# Altium schematic sheet CPU_STM32H7.SchDoc
size A3
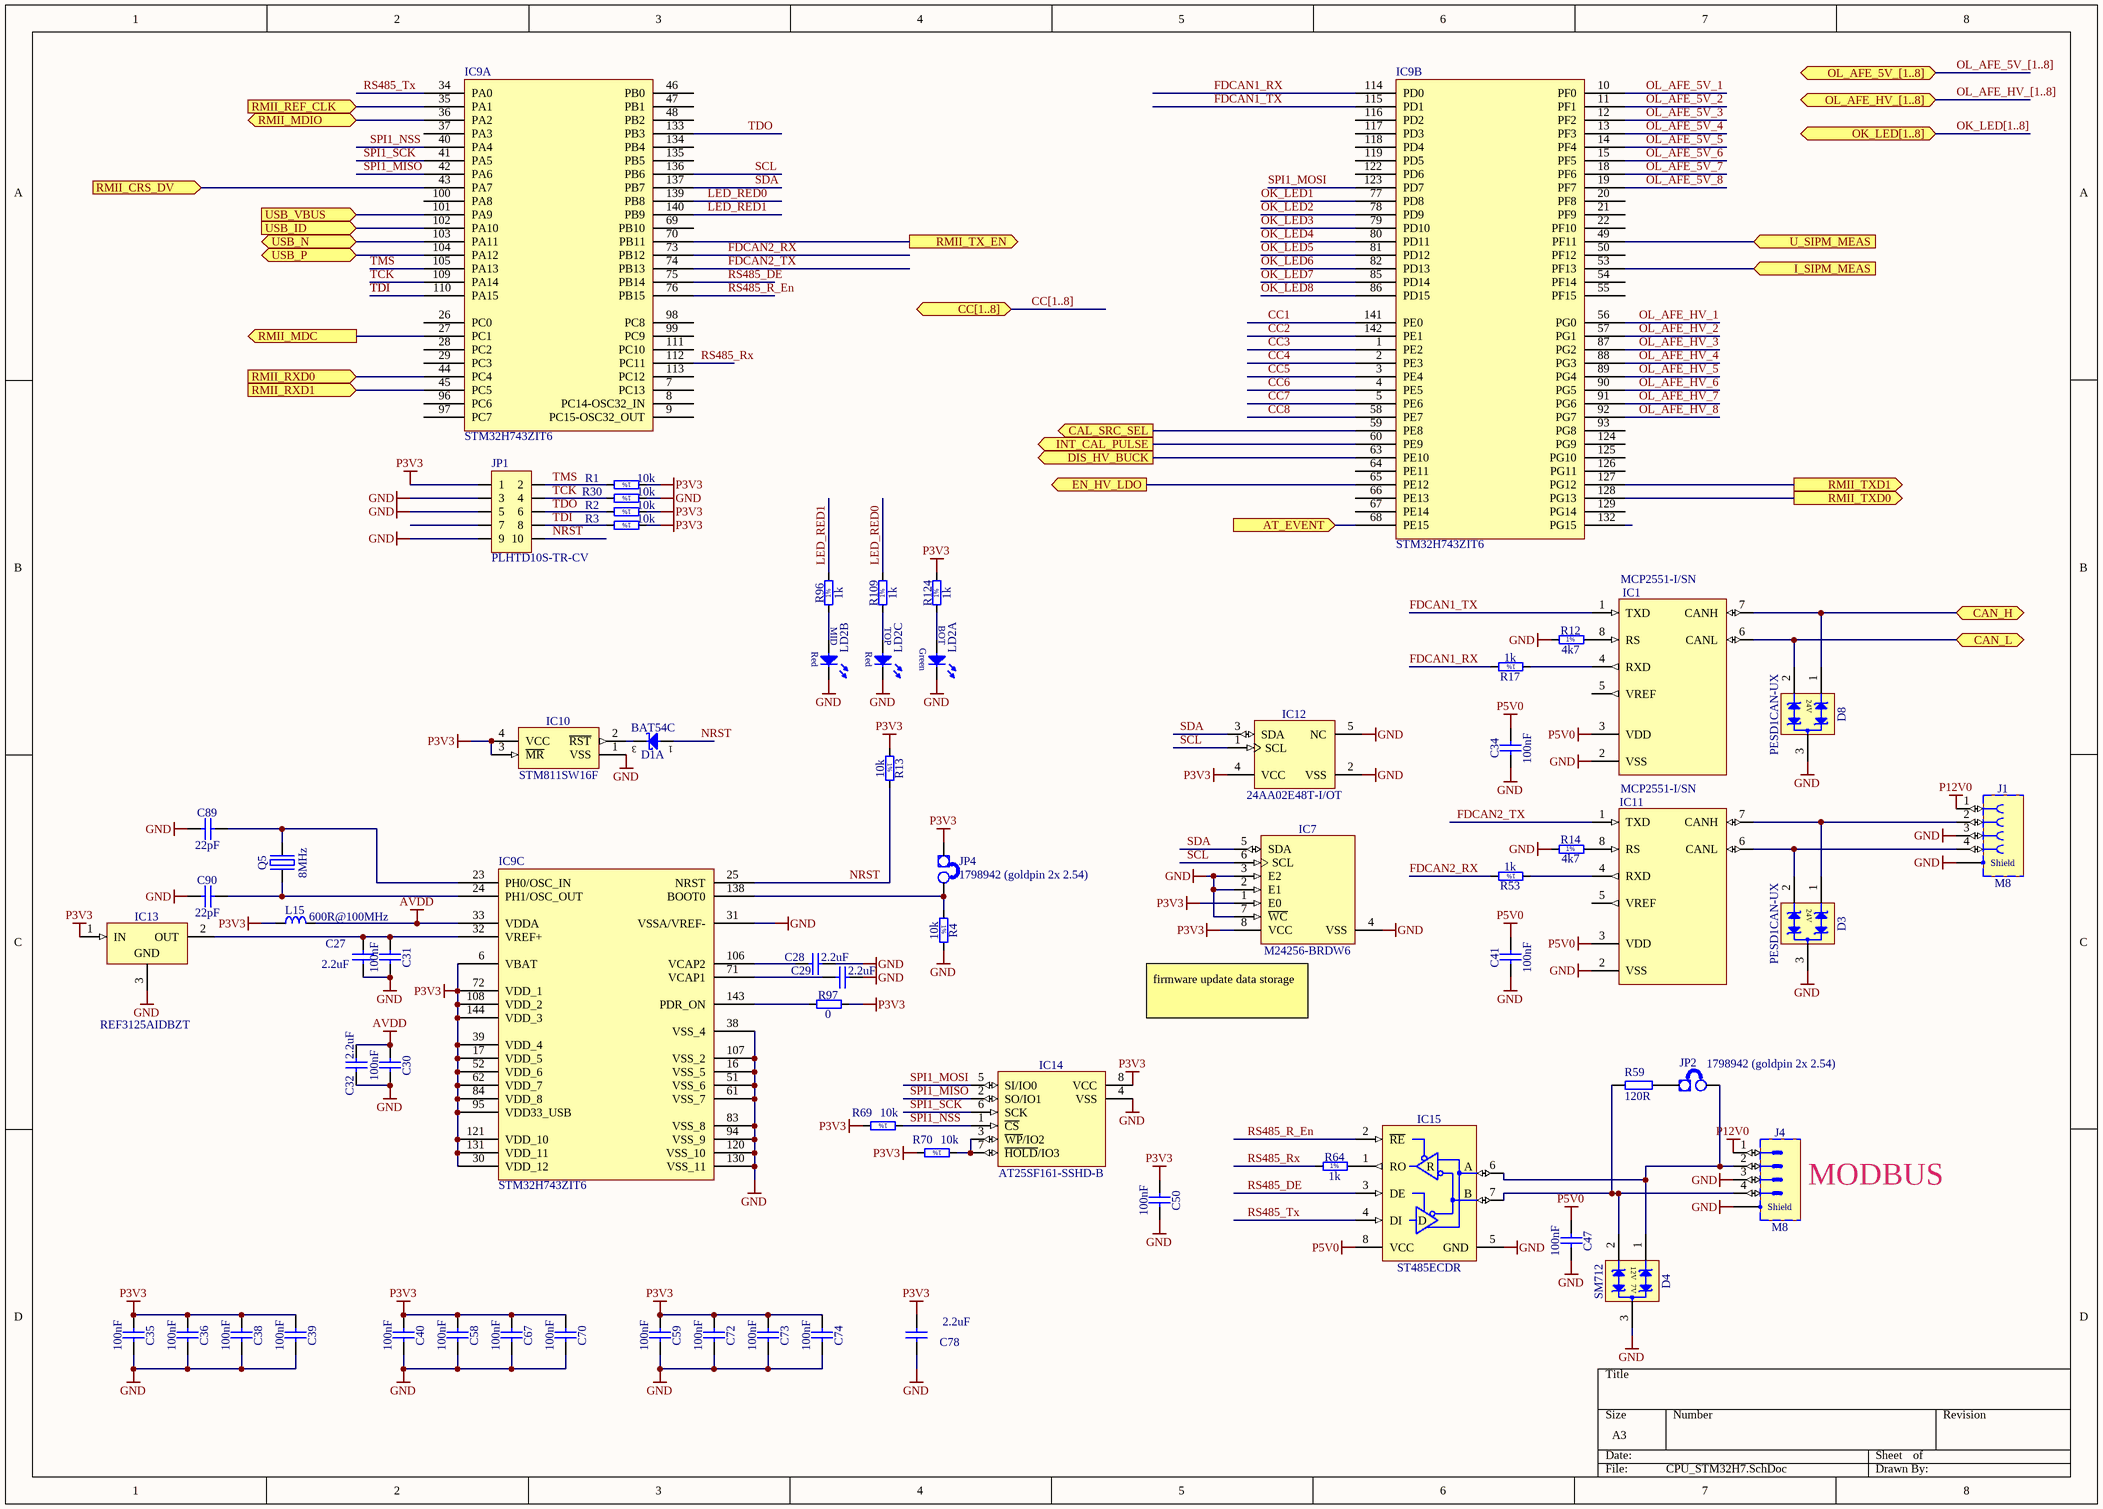
[diagram p0: CPU_STM32H7.SchDoc]

## Parts
C27  2.2uF  [CAPC1608X90N]
C28  2.2uF  [CAPC1608X90N]
C29  2.2uF  [CAPC1608X90N]
C30  100nF  [CAPC1005X55N]
C31  100nF  [CAPC1005X55N]
C32  2.2uF  [CAPC1608X90N]
C34  100nF  [CAPC1005X55N]
C35  100nF  [CAPC1005X55N]
C36  100nF  [CAPC1005X55N]
C38  100nF  [CAPC1005X55N]
C39  100nF  [CAPC1005X55N]
C40  100nF  [CAPC1005X55N]
C41  100nF  [CAPC1005X55N]
C47  100nF  [CAPC1005X55N]
C50  100nF  [CAPC1005X55N]
C58  100nF  [CAPC1005X55N]
C59  100nF  [CAPC1005X55N]
C67  100nF  [CAPC1005X55N]
C70  100nF  [CAPC1005X55N]
C72  100nF  [CAPC1005X55N]
C73  100nF  [CAPC1005X55N]
C74  100nF  [CAPC1005X55N]
C78  2.2uF  [CAPC1608X90N]
C89  22pF  [CAPC1005X55N]
C90  22pF  [CAPC1005X55N]
D1  BAT54C  [SOT95P240X130-3N]  (part A of 2)
D3  PESD1CAN-UX  [SOT95P237X112-3N]
D4  SM712  [SOT95P237X112-3N]
D8  PESD1CAN-UX  [SOT95P237X112-3N]
IC1  MCP2551-I/SN  [SOIC127P600X175-8N]
IC7  M24256-BRDW6  [SOP65P640X120-8N]
IC9  STM32H743ZIT6  [TSQFP50P2200X2200X160-144N]  (parts A,B,C of 3)
IC10  STM811SW16F  [SOT143N]
IC11  MCP2551-I/SN  [SOIC127P600X175-8N]
IC12  24AA02E48T-I/OT  [SOT95P280X145-5N]
IC13  REF3125AIDBZT  [SOT95P237X112-3N]
IC14  AT25SF161-SSHD-B  [SOIC127P790X216-8N]
IC15  ST485ECDR  [SOIC127P600X175-8N]
J1  M8  [AMPHENOL_M8AS-04PFFR-SF8001]
J4  M8  [AMPHENOL_M8AS-04PMMR-SF8001]
JP1  PLHTD10S-TR-CV  [PLHTD10S-TR-CV]
JP2  1798942 (goldpin 2x 2.54)  [jump]
JP4  1798942 (goldpin 2x 2.54)  [jump]
L15  600R@100MHz  [INDC1005X55N]
LD2  Red/Red/Green  [LED_DIALIGHT_570-0100-112F]  (value not drawn)  (parts A,B,C of 3)
Q5  8MHz  [XTAL_TXC_7A]
R1  10k  [RESC1005X40N]
R2  10k  [RESC1005X40N]
R3  10k  [RESC1005X40N]
R4  10k  [RESC1005X40N]
R12  4k7  [RESC1005X40N]
R13  10k  [RESC1005X40N]
R14  4k7  [RESC1005X40N]
R17  1k  [RESC1005X40N]
R30  10k  [RESC1005X40N]
R53  1k  [RESC1005X40N]
R59  120R  [1206R]
R64  1k  [RESC1005X40N]
R69  10k  [RESC1005X40N]
R70  10k  [RESC1005X40N]
R96  1k  [RESC1005X40N]
R97  0  [RESC1608X55N]
R109  1k  [RESC1005X40N]
R124  1k  [RESC1005X40N]

## Ports
AT_EVENT (in), CAL_SRC_SEL (out), CAN_H (bidir), CAN_L (bidir), CC[1..8] (bidir), DIS_HV_BUCK (out), EN_HV_LDO (out), I_SIPM_MEAS (in), INT_CAL_PULSE (out), OK_LED[1..8] (bidir), OL_AFE_5V_[1..8] (bidir), OL_AFE_HV_[1..8] (bidir), RMII_CRS_DV (in), RMII_MDC (out), RMII_MDIO (bidir), RMII_REF_CLK (in), RMII_RXD0 (in), RMII_RXD1 (in), RMII_TX_EN (out), RMII_TXD0 (out), RMII_TXD1 (out), U_SIPM_MEAS (in), USB_ID (in), USB_N (bidir), USB_P (bidir), USB_VBUS (in)

## Nets
AVDD: C30.1 C32.2 IC9.33(VDDA) L15.2
GND: C27.1 C28.2 C29.2 C30.2 C31.2 C32.1 C34.1 C35.2 C36.2 C38.2 C39.2 C40.2 C41.1 C47.2 C50.2 C58.2 C59.2 C67.2 C70.2 C72.2 C73.2 C74.2 C78.1 C89.1 C90.1 D3.3(GND) D4.3(GND) D8.3(GND) IC1.2(VSS) IC7.2(E1) IC7.3(E2) IC7.4(VSS) IC7.7(~{WC}) IC9.16(VSS_5) IC9.31(VSSA/VREF-) IC9.38(VSS_4) IC9.51(VSS_6) IC9.61(VSS_7) IC9.83(VSS_8) IC9.94(VSS_9) IC9.107(VSS_2) IC9.120(VSS_10) IC9.130(VSS_11) IC10.1(VSS) IC11.2(VSS) IC12.2(VSS) IC12.5(NC) IC13.3(GND) IC14.4(VSS) IC15.5(GND) J1.3 J1.SHIELD J4.3 J4.SHIELD JP1.3 JP1.5 JP1.9 LD2.2(C) LD2.4(C) LD2.6(C) R4.2 R12.1 R14.1 R30.1
P3V3: C35.1 C36.1 C38.1 C39.1 C40.1 C50.1 C58.1 C59.1 C67.1 C70.1 C72.1 C73.1 C74.1 C78.2 IC7.1(E0) IC7.8(VCC) IC9.6(VBAT) IC9.17(VDD_5) IC9.30(VDD_12) IC9.39(VDD_4) IC9.52(VDD_6) IC9.62(VDD_7) IC9.72(VDD_1) IC9.84(VDD_8) IC9.95(VDD33_USB) IC9.108(VDD_2) IC9.121(VDD_10) IC9.131(VDD_11) IC9.144(VDD_3) IC10.3(~{MR}) IC10.4(VCC) IC12.4(VCC) IC13.1(IN) IC14.8(VCC) JP1.1 JP4.1(E1) L15.1 R1.1 R2.1 R3.1 R13.1 R69.2 R70.2 R97.2 R124.2
P5V0: C34.2 C41.2 C47.1 IC1.3(VDD) IC11.3(VDD) IC15.8(VCC)
P12V0: J1.1 J4.1
AT_EVENT: IC9.68(PE15) ; port AT_EVENT
CAL_SRC_SEL: IC9.59(PE8) ; port CAL_SRC_SEL
CAN_H: D8.1(I/O1) IC1.7(CANH) ; port CAN_H
CAN_L: D8.2(I/O2) IC1.6(CANL) ; port CAN_L
CC1: IC9.141(PE0)
CC2: IC9.142(PE1)
CC3: IC9.1(PE2)
CC4: IC9.2(PE3)
CC5: IC9.3(PE4)
CC6: IC9.4(PE5)
CC7: IC9.5(PE6)
CC8: IC9.58(PE7)
DIS_HV_BUCK: IC9.63(PE10) ; port DIS_HV_BUCK
EN_HV_LDO: IC9.65(PE12) ; port EN_HV_LDO
FDCAN1_RX: IC9.114(PD0) R17.2
FDCAN1_TX: IC1.1(TXD) IC9.115(PD1)
FDCAN2_RX: IC9.73(PB12) R53.2
FDCAN2_TX: IC9.74(PB13) IC11.1(TXD)
I_SIPM_MEAS: IC9.53(PF13) ; port I_SIPM_MEAS
INT_CAL_PULSE: IC9.60(PE9) ; port INT_CAL_PULSE
LED_RED0: IC9.139(PB8) R109.2
LED_RED1: IC9.140(PB9) R96.2
NRST: D1.1(A) IC9.25(NRST) JP1.10 R13.2
OK_LED1: IC9.77(PD8)
OK_LED2: IC9.78(PD9)
OK_LED3: IC9.79(PD10)
OK_LED4: IC9.80(PD11)
OK_LED5: IC9.81(PD12)
OK_LED6: IC9.82(PD13)
OK_LED7: IC9.85(PD14)
OK_LED8: IC9.86(PD15)
OL_AFE_5V_1: IC9.10(PF0)
OL_AFE_5V_2: IC9.11(PF1)
OL_AFE_5V_3: IC9.12(PF2)
OL_AFE_5V_4: IC9.13(PF3)
OL_AFE_5V_5: IC9.14(PF4)
OL_AFE_5V_6: IC9.15(PF5)
OL_AFE_5V_7: IC9.18(PF6)
OL_AFE_5V_8: IC9.19(PF7)
OL_AFE_HV_1: IC9.56(PG0)
OL_AFE_HV_2: IC9.57(PG1)
OL_AFE_HV_3: IC9.87(PG2)
OL_AFE_HV_4: IC9.88(PG3)
OL_AFE_HV_5: IC9.89(PG4)
OL_AFE_HV_6: IC9.90(PG5)
OL_AFE_HV_7: IC9.91(PG6)
OL_AFE_HV_8: IC9.92(PG7)
RMII_CRS_DV: IC9.43(PA7) ; port RMII_CRS_DV
RMII_MDC: IC9.27(PC1) ; port RMII_MDC
RMII_MDIO: IC9.36(PA2) ; port RMII_MDIO
RMII_REF_CLK: IC9.35(PA1) ; port RMII_REF_CLK
RMII_RXD0: IC9.44(PC4) ; port RMII_RXD0
RMII_RXD1: IC9.45(PC5) ; port RMII_RXD1
RMII_TX_EN: IC9.70(PB11) ; port RMII_TX_EN
RMII_TXD0: IC9.128(PG13) ; port RMII_TXD0
RMII_TXD1: IC9.127(PG12) ; port RMII_TXD1
RS485_DE: IC9.75(PB14) IC15.3(DE)
RS485_R_En: IC9.76(PB15) IC15.2(~{RE})
RS485_Rx: IC9.112(PC11) R64.1
RS485_Tx: IC9.34(PA0) IC15.4(DI)
SCL: IC7.6(SCL) IC9.136(PB6) IC12.1(SCL)
SDA: IC7.5(SDA) IC9.137(PB7) IC12.3(SDA)
SPI1_MISO: IC9.42(PA6) IC14.2(SO/IO1)
SPI1_MOSI: IC9.123(PD7) IC14.5(SI/IO0)
SPI1_NSS: IC9.40(PA4) IC14.1(~{CS}) R69.1
SPI1_SCK: IC9.41(PA5) IC14.6(SCK)
TCK: IC9.109(PA14) JP1.4 R30.2
TDI: IC9.110(PA15) JP1.8 R3.2
TDO: IC9.133(PB3) JP1.6 R2.2
TMS: IC9.105(PA13) JP1.2 R1.2
U_SIPM_MEAS: IC9.49(PF11) ; port U_SIPM_MEAS
USB_ID: IC9.102(PA10) ; port USB_ID
USB_N: IC9.103(PA11) ; port USB_N
USB_P: IC9.104(PA12) ; port USB_P
USB_VBUS: IC9.101(PA9) ; port USB_VBUS
NetC27_2: C27.2 C31.1 IC9.32(VREF+) IC13.2(OUT)
NetC28_1: C28.1 IC9.106(VCAP2)
NetC29_1: C29.1 IC9.71(VCAP1)
NetC89_2: C89.2 IC9.23(PH0/OSC_IN) Q5.2(OSC2)
NetC90_2: C90.2 IC9.24(PH1/OSC_OUT) Q5.1(OSC1)
NetD1_3: D1.3(COMC) IC10.2(~{RST})
NetD3_1: D3.1(I/O1) IC11.7(CANH) J1.2
NetD3_2: D3.2(I/O2) IC11.6(CANL) J1.4
NetD4_1: D4.1(I/O1) IC15.6(A) J4.2 JP2.2(E2)
NetD4_2: D4.2(I/O2) IC15.7(B) J4.4 R59.1
NetIC1_4: IC1.4(RXD) R17.1
NetIC1_8: IC1.8(RS) R12.2
NetIC9_138: IC9.138(BOOT0) JP4.2(E2) R4.1
NetIC9_143: IC9.143(PDR_ON) R97.1
NetIC11_4: IC11.4(RXD) R53.1
NetIC11_8: IC11.8(RS) R14.2
NetIC14_3: IC14.3(~{WP}/IO2) IC14.7(~{HOLD}/IO3) R70.1
NetIC15_1: IC15.1(RO) R64.2
NetJP2_1: JP2.1(E1) R59.2
NetLD2_1: LD2.1(A) R124.1
NetLD2_3: LD2.3(A) R96.1
NetLD2_5: LD2.5(A) R109.1

Not connected (* = marked no-connect by the designer): IC1 5(VREF); IC9 7(PC13) 8(PC14-OSC32_IN) 9(PC15-OSC32_OUT) 20(PF8) 21(PF9) 22(PF10) 26(PC0) 28(PC2) 29(PC3) 37(PA3) 46(PB0) 47(PB1) 48(PB2) 50(PF12) 54(PF14) 55(PF15) 64(PE11) 66(PE13) 67(PE14) 69(PB10) 93(PG8) 96(PC6) 97(PC7) 98(PC8) 99(PC9) 100(PA8) 111(PC10) 113(PC12) 116(PD2) 117(PD3) 118(PD4) 119(PD5) 122(PD6) 124(PG9) 125(PG10) 126(PG11) 129(PG14) 132(PG15) 134(PB4) 135(PB5); IC11 5(VREF); JP1 7

## Buses and harness runs
bus CC[1..8] = port CC[1..8]
bus OK_LED[1..8] = port OK_LED[1..8]
bus OL_AFE_5V_[1..8] = port OL_AFE_5V_[1..8]
bus OL_AFE_HV_[1..8] = port OL_AFE_HV_[1..8]

## Notes on the sheet
- (near IC7) firmware update data storage
- (near J4) MODBUS
- (in symbol AMPHENOL_M8AS-04PFFR-SF8001) Shield
- (in symbol AMPHENOL_M8AS-04PMMR-SF8001) Shield
- (in symbol LED_DIALIGHT_570-0100-112F, part A) BOT; Green
- (in symbol LED_DIALIGHT_570-0100-112F, part B) MID; Red
- (in symbol LED_DIALIGHT_570-0100-112F, part C) TOP; Red
- (in symbol R0402_1K_1%_0.0625W_100PPM) 1%
- (in symbol R0402_4K7_1%_0.0625W_100PPM) 1%
- (in symbol R0402_10K_1%_0.0625W_100PPM) 1%
- (in symbol SM712) 12V; 7V
- (in symbol ST485ECDR) R; D

## Library data of the parts
C27-C29 C32 C78 = CC0603_2.2UF_10V_20%_X7R: Non-polarised capacitor; Part Description: SMD Multilayer Chip Ceramic Capacitor; Manufacturer: GENERIC; Manufacturer1 Part Number: LMK107B7225MA-T; Voltage: 10V; TC: X7R; Tolerance: ±20%; Part Number: CC0603_2.2UF_10V_20%_X7R; Component Kind: Standard; Component Type: Standard; Pin Count: 2; Value: 2.2uF; Status: Not Recommended; Manufacturer Part Number: CC0603_2.2UF_10V_20%_X7R; Case: 0603; Mounted: Yes; Socket: No; SMD: Yes; Sense: No; Manufacturer1 Example: TAIYO YUDEN; Manufacturer1 ComponentHeight: 0.9mm; HelpURL: \\cern.ch\dfs\Applications\Altium\Datasheets\CC0603_X7R_TAIYO-YUDEN_HIGH-VALUE.pdf; Author: CERN DEM JLC; CreateDate: 22/06/2011; LatestRevisionDate: 27/06/2011
C30 C31 C34-C36 C38-C41 C47 C50 C58 C59 C67 C70 C72-C74 = CC0402_100NF_16V_10%_X7R: Non-polarised capacitor; Part Description: SMD Multilayer Chip Ceramic Capacitor; Manufacturer: GENERIC; Manufacturer1 Part Number: GRM155R71C104KA88D; Voltage: 16V; TC: X7R; Tolerance: ±10%; Value: 100nF; Part Number: CC0402_100NF_16V_10%_X7R; Component Kind: Standard; Component Type: Standard; Pin Count: 2; Status: Not Recommended; Manufacturer Part Number: CC0402_100NF_16V_10%_X7R; Case: 0402; Mounted: Yes; Socket: No; SMD: Yes; Sense: No; Manufacturer1 Example: MURATA; Manufacturer1 ComponentHeight: 0.55mm; HelpURL: \\cern.ch\dfs\Applications\Altium\Datasheets\CC0402_X7R_MURATA_GRM.pdf; Author: CERN DEM JLC; CreateDate: 05.12.2013; LatestRevisionDate: 03.12.2007
C89 C90 = CC0402_22PF_50V_5%_C0G: Non-polarised capacitor; Part Description: SMD Multilayer Chip Ceramic Capacitor; Manufacturer: GENERIC; Manufacturer1 Part Number: C0402C220J5GACTU; Voltage: 50V; TC: C0G/NP0; Tolerance: ±5%; Part Number: CC0402_22PF_50V_5%_C0G; Component Kind: Standard; Component Type: Standard; Pin Count: 2; Value: 22pF; Status: Preferred; Manufacturer Part Number: CC0402_22PF_50V_5%_C0G; Case: 0402; Mounted: Yes; Socket: No; SMD: Yes; Sense: No; Manufacturer1 Example: KEMET; Manufacturer1 ComponentHeight: 0.55mm; HelpURL: \\cern.ch\dfs\Applications\Altium\Datasheets\CC0805_C0G_KEMET_(Commercial Grade).pdf; Author: CERN DEM JLC; CreateDate: 03/12/2007; LatestRevisionDate: 03/12/2007
D1 = BAT54C: Dual Common Cathode Schottky Diodes; Part Description: Dual Common Cathode Small Signal Schottky Diode; Manufacturer: FAIRCHILD SEMICONDUCTOR; Voltage: 30V; Power: 200mA; PressFit: No; Bonding: No; Part Number: BAT54C; Component Kind: Standard; Component Type: Standard; Device: BAT54C; PackageDescription: SOT23 3-Leads, Pitch 0.95mm - Body 1.3x2.9mm, IPC Medium Density; Manufacturer Part Number: BAT54C; Pin Count: 3; Case: SOT23-3; Mounted: Yes; Socket: No; SMD: Yes; ComponentHeight: 1.30mm; HelpURL: \\cern.ch\dfs\Applications\Altium\Datasheets\BAT54C.pdf; Author: CERN DEM JLC; CreateDate: 17.09.2009; LatestRevisionDate: 27.05.2010; Sense: No
D3 D8 = D_TVS_PESD1CAN: TVS Diode for CAN; Manufacturer: Nexperia; Voltage: 24V; Power: 400W; PressFit: No; Bonding: No; Part Number: PESD1CAN-UX; Component Kind: Standard; Component Type: Standard; Device: PESD1CAN-UX; PackageDescription: SOT, 0.95mm, pitch; 3 pin,1.30mm W X 2.92mm L X 1.12mm H body, IPC Medium Density; Part Description: TVS Diode for CAN; Manufacturer Part Number: PESD1CAN-UX; Pin Count: 3; Case: SOT-23; Mounted: Yes; Socket: No; SMD: Yes; Sense: No; ComponentHeight: 1.12mm; HelpURL: \\cern.ch\dfs\Applications\Altium\Datasheets\SM712.TCT.pdf; Author: CERN DEM JLC; CreateDate: 03.09.2014; LatestRevisionDate: 13.01.2015
D4 = SM712: Asymmetrical TVS Diode for Extended Common-Mode RS-485; Manufacturer: SEMTECH; Voltage: 12V/-7V; Power: 400W; PressFit: No; Bonding: No; Part Number: SM712; Component Kind: Standard; Component Type: Standard; Device: SM712; PackageDescription: SOT, 0.95mm, pitch; 3 pin,1.30mm W X 2.92mm L X 1.12mm H body, IPC Medium Density; Status: Obsolete; Part Description: Asymmetrical TVS Diode for Extended Common-Mode RS-485; Manufacturer Part Number: SM712; Pin Count: 3; Case: SOT-23; Mounted: Yes; Socket: No; SMD: Yes; Sense: No; ComponentHeight: 1.12mm; HelpURL: \\cern.ch\dfs\Applications\Altium\Datasheets\SM712.pdf; Author: CERN DEM JLC; CreateDate: 23.04.2012; LatestRevisionDate: 23.04.2012
IC1 IC11 = IFC_MCP2551: High-Speed CAN Transceiver, 8-Pin SOIC, Industrial Temperature; Manufacturer: MICROCHIP TECHNOLOGY; PressFit: No; Bonding: No; Part Number: MCP2551-I/SN; Component Kind: Standard; Component Type: Standard; Device: MCP2551-I/SN; PackageDescription: SOIC 8, Pitch 1.27mm - Body 4x5mm, IPC Medium Density; Part Description: High-Speed CAN Transceiver; Manufacturer Part Number: MCP2551-I/SN; Pin Count: 8; Case: SOIC8; Mounted: Yes; Socket: No; SMD: Yes; Sense: No; ComponentHeight: 1.75mm; Author: GK; CreateDate: 07.09.2016; LatestRevisionDate: 07.09.2016
IC7 = MEM_M24256-BRDW6P: 256-Kbit Serial I²C Bus EEPROM; Manufacturer: ST MICROELECTRONICS; PressFit: No; Bonding: No; Part Number: M24256-BRDW6P; Component Kind: Standard; Component Type: Standard; Device: M24256-BRDW6; PackageDescription: SOP, 0.65mm pitch; 8 pin, 4.40mm W X 3.00mm L X 1.20mm H body, IPC Medium Density; Part Description: 256-Kbit Serial I²C Bus EEPROM; Manufacturer Part Number: M24256-BRDW6; Pin Count: 8; Case: TSSOP8; Mounted: Yes; Socket: No; SMD: Yes; Sense: No; ComponentHeight: 1.2mm; HelpURL: \\cern.ch\dfs\Applications\Altium\Datasheets\M24256-BRDW6P.pdf; Author: CERN DEM MR; CreateDate: 17.03.2016; LatestRevisionDate: 17.03.2016
IC9 = UPC_STM32H743ZIT6: 32-bit Arm® Cortex-M7 400MHz MCUs, up to 2MB Flash, / 1MB RAM, 46 com. and analog interfaces
IC10 = STM811SW16F: Microprocessor Reset Circuit; Part Description: 2.93V Reset Threshold Voltage Microprocessor Reset Circuit; Manufacturer: ST MICROELECTRONICS; PressFit: No; Bonding: No; Part Number: STM811SW16F; Component Kind: Standard; Component Type: Standard; Device: STM811SW16F; PackageDescription: SOT143, 4-Leads, Body 3.0x2.6mm (max), Pitch 1.92mm, IPC Medium Density; Manufacturer Part Number: STM811SW16F; Pin Count: 4; Case: SOT143; Mounted: Yes; Socket: No; SMD: Yes; Sense: No; ComponentHeight: 1.12mm; Author: CERN DEM JLC; HelpURL: \\cern.ch\dfs\Applications\Altium\Datasheets\STM811SW16F.pdf; CreateDate: 17.11.2016; LatestRevisionDate: 17.11.2016
IC12 = 24AA02E48T-I/OT: 1.7V-5.5V, 2K I2C Serial EEPROM With EUI-48 Node Identity; Manufacturer: MICROCHIP TECHNOLOGY; PressFit: No; Bonding: No; Part Number: 24AA02E48T-I/OT; Component Kind: Standard; Component Type: Standard; Device: 24AA02E48T-I/OT; PackageDescription: SOT, 0.95mm pitch; 5 pin, 1.60mm W X 2.90mm L X 1.45mm H body, IPC Medium Density; Part Description: 1.7V-5.5V, 2K I2C Serial EEPROM With EUI-48 Node Identity; Manufacturer Part Number: 24AA02E48T-I/OT; Pin Count: 5; Case: SOT23-5; Mounted: Yes; Socket: No; SMD: Yes; Sense: No; ComponentHeight: 1.45mm; HelpURL: \\cern.ch\dfs\Applications\Altium\Datasheets\24AA02E48T-I-OT.pdf; Author: CERN DEM MR; CreateDate: 31.03.2016; LatestRevisionDate: 31.03.2016
IC13 = REF3125AIDBZT: 3-Terminal Regulator 1=IN 2=OUT 3=GND; Part Description: 2.5V, 30ppm/°C Max, 100uA, Voltage Reference; Manufacturer: TEXAS INSTRUMENTS; PressFit: No; Bonding: No; Part Number: REF3125AIDBZT; Component Kind: Standard; Component Type: Standard; Device: REF3125AIDBZT; PackageDescription: SOT, 0.95mm, pitch; 3 pin,1.30mm W X 2.92mm L X 1.12mm H body, IPC Medium Density; Manufacturer Part Number: REF3125AIDBZT; Pin Count: 3; Case: SOT23; Mounted: Yes; Socket: No; SMD: Yes; Sense: No; ComponentHeight: 1.12mm; HelpURL: \\cern.ch\dfs\Applications\Altium\Datasheets\REF3125AIDBZT.pdf; Author: CERN DEM MR; CreateDate: 15.10.2018; LatestRevisionDate: 15.10.2018
IC14 = MEM_AT25SF161: 16Mb, 3V, Multiple I/O Serial NOR Flash Memory; Part Description: 16Mb, 2.7 to 3.6V, SPI Flash Memory; PressFit: No; Bonding: No; Part Number: AT25SF161-SSHD-B; Component Kind: Standard; Component Type: Standard; Device: AT25SF161-SSHD-B; PackageDescription: SOIC, 1.27mm Pitch; 8 Pin, 5.285mm W X 5.335mm L X 2.16mm H body, IPC Medium Density; Manufacturer Part Number: AT25SF161-SSHD-B; Pin Count: 8; Case: SOIC8; Mounted: Yes; Socket: No; SMD: Yes; Sense: No; ComponentHeight: 2.16mm; HelpURL: \\cern.ch\dfs\Applications\Altium\Datasheets\N25Q128A13ESE40.pdf; Author: GK; CreateDate: 28.11.2011; LatestRevisionDate: 30.07.2015
IC15 = ST485ECDR: ±15kV ESD-Protected, Low Power  RS-485/RS-422 Transceiver; Manufacturer: ST MICROELECTRONICS; PressFit: No; Bonding: No; Part Number: ST485ECDR; Component Kind: Standard; Component Type: Standard; Device: ST485ECDR; PackageDescription: SOIC 8, Pitch 1.27mm - Body 4x5mm, IPC Medium Density; Part Description: ±15kV ESD-Protected, Low Power  RS-485/RS-422 Transceiver; Manufacturer Part Number: ST485ECDR; Pin Count: 8; Case: SOIC8; Mounted: Yes; Socket: No; SMD: Yes; Sense: No; ComponentHeight: 1.75mm; Author: CERN DEM MR; HelpURL: \\cern.ch\dfs\Applications\Altium\Datasheets\ST485ECDR.pdf; CreateDate: 15.02.2018; LatestRevisionDate: 15.02.2018
J1 = AMPHENOL_M8AS-04PFFR-SF8001: Connector 4 Female + Shield; Part Description: 4 Contacts,  IP68 Sealing Level, Right Angled M8 Circular Receptacle; PressFit: No; Part Number: AMPHENOL_M8AS-04PFFR-SF8001; Component Kind: Standard; Component Type: Standard; Pin Count: 6; Family: M8; Mounted: Yes; Socket: No; SMD: No; Sense: No; Status: None; Manufacturer: AMPHENOL; Manufacturer Part Number: M8AS-04PFFR-SF8001; ComponentHeight: 12.65mm; HelpURL: \\cern.ch\dfs\Applications\Altium\Datasheets\AMPHENOL_M8AS-04PFFR-SF8001.pdf; Author: CERN DEM MR; CreateDate: 08.04.2019; LatestRevisionDate: 08.04.2019
J4 = AMPHENOL_M8AS-04PMMR-SF8001: Connector 4 Male + Shield; Part Description: 4 Contacts,  IP68 Sealing Level, Right Angled M8 Circular Header; PressFit: No; Part Number: AMPHENOL_M8AS-04PMMR-SF8001; Component Kind: Standard; Component Type: Standard; Pin Count: 6; Family: M8; Mounted: Yes; Socket: No; SMD: No; Sense: No; Status: None; Manufacturer: AMPHENOL; Manufacturer Part Number: M8AS-04PMMR-SF8001; ComponentHeight: 12.65mm; HelpURL: \\cern.ch\dfs\Applications\Altium\Datasheets\AMPHENOL_M8AS-04PMMR-SF8001.pdf; Author: CERN DEM MR; CreateDate: 08.04.2019; LatestRevisionDate: 08.04.2019
JP1 = CON_2x5 1.27 SMT Male: 1.27 mm dual row goldpin (Maritex)
JP2 JP4 = JUMPER: Supplier 1: Farnell; Supplier Part Number 1: 1798942
L15 = IND0402_MURATA_BLM15HD601SN1: Inductor; Part Description: SMD EMIFIL Suppression Chip Ferrite Bead; Manufacturer: MURATA; Manufacturer Part Number: BLM15HD601SN1D; Power: 300mA; Resistance: 0.85R; Tolerance: ±25%; Part Number: IND0402_MURATA_BLM15HD601SN1; Component Kind: Standard; Component Type: Standard; Pin Count: 2; Value: 600R@100MHz; Status: None; Case: 0402; Mounted: Yes; Socket: No; SMD: Yes; Sense: No; ComponentHeight: 0.55mm; HelpURL: \\cern.ch\dfs\Applications\Altium\Datasheets\IND0402_MURATA_BLM15H.pdf; Author: CERN DEM JLC; CreateDate: 28/02/2012; LatestRevisionDate: 28/02/2012
LD2 = LED_DIALIGHT_570-0100-112F: LED x3  Top Red, Middle Red, Bottom Green; Part Description: Triple 2mm CBI® LEDs, Red Top, Red Middle, Green Bottom; PressFit: No; Bonding: No; Part Number: LED_DIALIGHT_570-0100-112F; Component Kind: Standard; Component Type: Standard; Color: Red/Red/Green; PackageDescription: 3x 2mm LED (Top: Red , Middle: Red, Bot: Green) PCB Edge Mounting DIALIGHT 570 Serie; Manufacturer: DIALIGHT; Manufacturer Part Number: 570-0100-112F; Pin Count: 6; Mounted: Yes; Socket: No; SMD: No; Sense: No; ComponentHeight: 10.41mm; HelpURL: \\cern.ch\dfs\Applications\Altium\Datasheets\LED_DIALIGHT_570-0100-112F.pdf; Author: CERN DEM JLC; CreateDate: 21.01.2013; LatestRevisionDate: 21.01.2013
Q5 = XTAL_8MHZ_TXC_7A-8.000MAAE-T: Quartz Crystal; Part Description: Tolerance: ±30ppm, Stability: ±30ppm, -20°C to +70°C, 12pF, SMD Glass Seam Sealing Crystal, 7A Series; Manufacturer: TXC CORPORATION; PressFit: No; Bonding: No; Part Number: XTAL_8MHZ_TXC_7A-8.000MAAE-T; Component Kind: Standard; Component Type: Standard; PackageDescription: 2 Pins, 3.2x5mm, SMD Glass Seam Sealing Crystal, 7A Serie; Value: 8MHz; Manufacturer Part Number: 7A-8.000MAAE-T; Pin Count: 2; Mounted: Yes; Socket: No; SMD: Yes; Sense: No; ComponentHeight: 1.2mm; HelpURL: \\cern.ch\dfs\Applications\Altium\Datasheets\XTAL_TXC_7A.pdf; Author: CERN DEM JLC; CreateDate: 09/10/2014; LatestRevisionDate: 12/11/2014
R1-R3 R30 R69 R70 = R0402_10K_1%_0.0625W_100PPM: Resistor - 1%; Part Description: General Purpose Thick Film Chip Resistor; Manufacturer: GENERIC; Manufacturer1 Part Number: 232270671003L; TC: ±100ppm/°C; Table: Resistors SMD; Part Number: R0402_10K_1%_0.0625W_100PPM; Component Kind: Standard; Component Type: Standard; Pin Count: 2; Value: 10k; Status: Not recommended; Power: 0.0625W; Tolerance: ±1%; Manufacturer Part Number: R0402_10K_1%_0.0625W_100PPM; Case: 0402; Mounted: Yes; Socket: No; SMD: Yes; Manufacturer1 Example: YAGEO PHYCOMP; Manufacturer1 ComponentHeight: 0.4mm; HelpURL: \\cern.ch\dfs\Applications\Altium\Datasheets\R0402_Phycomp_RC0402.pdf; Author: CERN DEM JLC; CreateDate: 2007-12-03; LatestRevisionDate: 2012-10-17
R4 R13 = R0402_10K_1%_0.0625W_100PPM: Resistor - 1%; Part Description: General Purpose Thick Film Chip Resistor; Manufacturer: GENERIC; Manufacturer1 Part Number: 232270671003L; TC: ±100ppm/°C; PressFit: No; Value: 10k; Part Number: R0402_10K_1%_0.0625W_100PPM; Component Kind: Standard; Component Type: Standard; Pin Count: 2; Status: Not Recommended; Power: 0.0625W; Tolerance: ±1%; Manufacturer Part Number: R0402_10K_1%_0.0625W_100PPM; Case: 0402; Mounted: Yes; Sense: No; Socket: No; SMD: Yes; Manufacturer1 Example: YAGEO PHYCOMP; Manufacturer1 ComponentHeight: 0.4mm; HelpURL: \\cern.ch\dfs\Applications\Altium\Datasheets\R0402_Phycomp_RC0402.pdf; Author: CERN DEM JLC; CreateDate: 03/12/2007; LatestRevisionDate: 17/10/2012
R12 R14 = R0402_4K7_1%_0.0625W_100PPM: Resistor - 1%; Part Description: General Purpose Thick Film Chip Resistor; Manufacturer: GENERIC; Manufacturer1 Part Number: 232270674702L; TC: ±100ppm/°C; PressFit: No; Part Number: R0402_4K7_1%_0.0625W_100PPM; Component Kind: Standard; Component Type: Standard; Pin Count: 2; Value: 4k7; Status: Not Recommended; Power: 0.0625W; Tolerance: ±1%; Manufacturer Part Number: R0402_4K7_1%_0.0625W_100PPM; Case: 0402; Mounted: Yes; Sense: No; Socket: No; SMD: Yes; Manufacturer1 Example: YAGEO PHYCOMP; Manufacturer1 ComponentHeight: 0.4mm; HelpURL: \\cern.ch\dfs\Applications\Altium\Datasheets\R0402_Phycomp_RC0402.pdf; Author: CERN DEM JLC; CreateDate: 03.12.2007; LatestRevisionDate: 17.10.2012
R17 R53 R64 R96 R109 R124 = R0402_1K_1%_0.0625W_100PPM: Resistor - 1%; Part Description: General Purpose Thick Film Chip Resistor; Manufacturer: GENERIC; Manufacturer1 Part Number: 232270671002L; TC: ±100ppm/°C; PressFit: No; Part Number: R0402_1K_1%_0.0625W_100PPM; Component Kind: Standard; Component Type: Standard; Pin Count: 2; Value: 1k; Status: Not Recommended; Power: 0.0625W; Tolerance: ±1%; Manufacturer Part Number: R0402_1K_1%_0.0625W_100PPM; Case: 0402; Mounted: Yes; Sense: No; Socket: No; SMD: Yes; Manufacturer1 Example: YAGEO PHYCOMP; Manufacturer1 ComponentHeight: 0.4mm; HelpURL: \\cern.ch\dfs\Applications\Altium\Datasheets\R0402_Phycomp_RC0402.pdf; Author: CERN DEM JLC; CreateDate: 03.12.2007; LatestRevisionDate: 17.10.2012
R59 = RES_1206: SMD Resistor; Supplier 1: Newark; Supplier Part Number 1: 39K0871
R97 = R0603_0R_JUMPER: Resistor; Part Description: 1A (0.05R Max DC Resistance) Zero Ohm Jumper; Manufacturer: GENERIC; Manufacturer1 Part Number: NRC06Z0; PressFit: No; Part Number: R0603_0R_JUMPER; Component Kind: Standard; Component Type: Standard; Pin Count: 2; Value: 0; Status: Preferred; Manufacturer Part Number: R0603_0R_JUMPER; Case: 0603; Mounted: Yes; Sense: No; Socket: No; SMD: Yes; Manufacturer1 Example: NIC COMPONENT; Manufacturer1 ComponentHeight: 0.55mm; HelpURL: \\cern.ch\dfs\Applications\Altium\Datasheets\R0603_NIC_NRC.pdf; Author: CERN DEM JLC; CreateDate: 03.12.2007; LatestRevisionDate: 13.03.2008